# EasyEDA Pro project Schematic.epro

# Schematic Circuit Wenglor
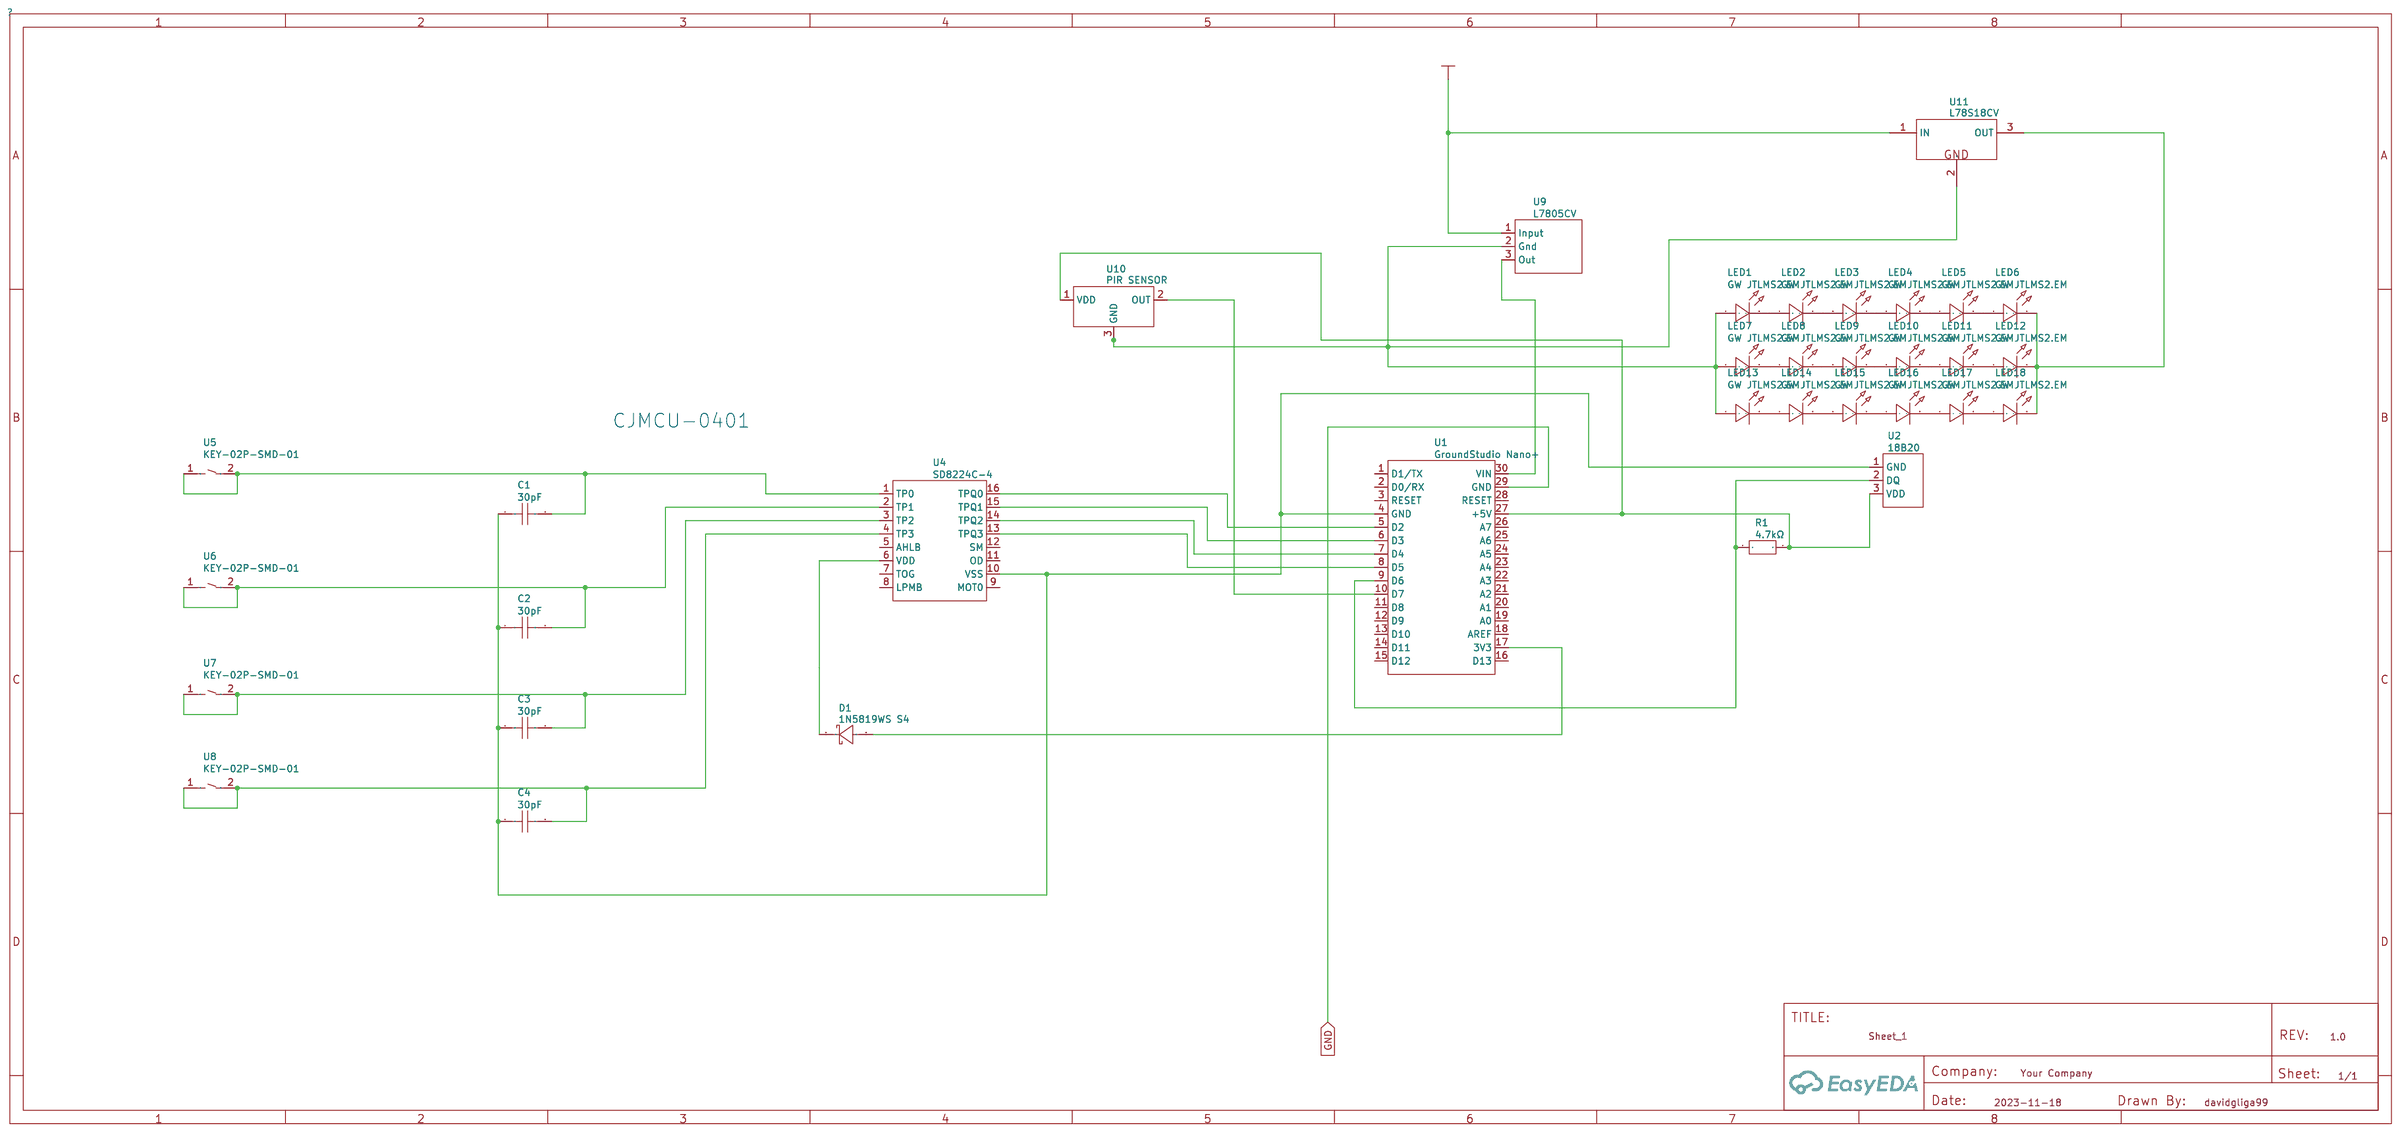
[diagram p0: schematic sheet]

## Parts
C1  30pF  [C0402]
C2  30pF  [C0402]
C3  30pF  [C0402]
C4  30pF  [C0402]
D1  1N5819WS S4  [SOD-323_L1.6-W1.3-LS2.7-RD]
LED1  GW JTLMS2.EM  [LED-SMD_L3.5-W2.8_28353V60MA6500K]
LED2  GW JTLMS2.EM  [LED-SMD_L3.5-W2.8_28353V60MA6500K]
LED3  GW JTLMS2.EM  [LED-SMD_L3.5-W2.8_28353V60MA6500K]
LED4  GW JTLMS2.EM  [LED-SMD_L3.5-W2.8_28353V60MA6500K]
LED5  GW JTLMS2.EM  [LED-SMD_L3.5-W2.8_28353V60MA6500K]
LED6  GW JTLMS2.EM  [LED-SMD_L3.5-W2.8_28353V60MA6500K]
LED7  GW JTLMS2.EM  [LED-SMD_L3.5-W2.8_28353V60MA6500K]
LED8  GW JTLMS2.EM  [LED-SMD_L3.5-W2.8_28353V60MA6500K]
LED9  GW JTLMS2.EM  [LED-SMD_L3.5-W2.8_28353V60MA6500K]
LED10  GW JTLMS2.EM  [LED-SMD_L3.5-W2.8_28353V60MA6500K]
LED11  GW JTLMS2.EM  [LED-SMD_L3.5-W2.8_28353V60MA6500K]
LED12  GW JTLMS2.EM  [LED-SMD_L3.5-W2.8_28353V60MA6500K]
LED13  GW JTLMS2.EM  [LED-SMD_L3.5-W2.8_28353V60MA6500K]
LED14  GW JTLMS2.EM  [LED-SMD_L3.5-W2.8_28353V60MA6500K]
LED15  GW JTLMS2.EM  [LED-SMD_L3.5-W2.8_28353V60MA6500K]
LED16  GW JTLMS2.EM  [LED-SMD_L3.5-W2.8_28353V60MA6500K]
LED17  GW JTLMS2.EM  [LED-SMD_L3.5-W2.8_28353V60MA6500K]
LED18  GW JTLMS2.EM  [LED-SMD_L3.5-W2.8_28353V60MA6500K]
R1  4.7kΩ  [RES-TH_BD2.4-L6.3-P10.30-D0.6]
U1  GroundStudio Nano+  [COMM-TH_ARDUINO_NANO]
U2  18B20  [TO-92-3_L4.9-W3.7-P2.54-L]
U4  SD8224C-4  [SOP-16_L10.0-W3.9-P1.27-LS6.0-BL]
U5  KEY-02P-SMD-01  [KEY-SMD_L4.0-W3.0-LS4.9]
U6  KEY-02P-SMD-01  [KEY-SMD_L4.0-W3.0-LS4.9]
U7  KEY-02P-SMD-01  [KEY-SMD_L4.0-W3.0-LS4.9]
U8  KEY-02P-SMD-01  [KEY-SMD_L4.0-W3.0-LS4.9]
U9  L7805CV  [TO-220-3_L10.0-W4.5-P2.54-L]
U10  PIR SENSOR  [PIR-TH_EKMB4308112K]
U11  L78S18CV

## Library data of the parts
C1-C4 = 30pF: Supplier: LCSC; Supplier Part: C726127; Manufacturer: YAGEO(国巨); Manufacturer Part: AC0402JRNPO9BN300; JLCPCB Part Class: Extended Part; link: https://lcsc.com/eda_search?q=C726127&amp;%26type=1&amp;ref=editor
D1 = 1N5819WS S4: Supplier: LCSC; Supplier Part: C2927280; Manufacturer: JSMSEMI(杰盛微); JLCPCB Part Class: Extended Part; link: https://lcsc.com/eda_search?q=C2927280&amp;%26type=1&amp;ref=editor
LED1-LED18 = GW JTLMS2.EM: Supplier: LCSC; Supplier Part: C9900023603; Manufacturer: null; JLCPCB Part Class: Extended Part; link: https://lcsc.com/eda_search?q=C9900023603&amp;%26type=1&amp;ref=editor
R1 = 4.7kΩ: Supplier: LCSC; Supplier Part: C385509; Manufacturer: Tyohm(幸亚电阻); Manufacturer Part: RN1/2WS4.7KΩFT/BA1; JLCPCB Part Class: Extended Part; link: https://lcsc.com/eda_search?q=C385509&amp;%26type=1&amp;ref=editor
U1 = GroundStudio Nano+: Supplier: LCSC; Supplier Part: C9900017879; Manufacturer: null; Manufacturer Part: ARDUINO_NANO; JLCPCB Part Class: Extended Part; link: https://lcsc.com/eda_search?q=C9900017879&amp;%26type=1&amp;ref=editor
U2 = 18B20: Supplier: LCSC; Supplier Part: C4945083; Manufacturer: I-CORE(中微爱芯); JLCPCB Part Class: Extended Part; link: https://lcsc.com/eda_search?q=C4945083&amp;%26type=1&amp;ref=editor
U4 = SD8224C-4: Supplier: LCSC; Supplier Part: C521406; Manufacturer: SHOUDING(首鼎半导体); JLCPCB Part Class: Extended Part; link: https://lcsc.com/eda_search?q=C521406&amp;%26type=1&amp;ref=editor
U5-U8 = KEY-02P-SMD-01: Supplier: LCSC; Supplier Part: C9900002655; Manufacturer: null; JLCPCB Part Class: Extended Part; link: https://lcsc.com/eda_search?q=C9900002655&amp;%26type=1&amp;ref=editor
U9 = L7805CV: Supplier: LCSC; Supplier Part: C347289; Manufacturer: UMW(广东友台半导体); JLCPCB Part Class: Extended Part
U10 = PIR SENSOR: Supplier: LCSC; Supplier Part: C3678765; Manufacturer: PANASONIC(松下); Manufacturer Part: EKMC1609112
U11 = L78S18CV

## Nets
24V: U9.1(Input) U11.1(IN)
GND: U1.29(GND)
Net-(C1-1): C1.1 C2.1 C3.1 C4.1 U1.4(GND) U2.1(GND) U4.10(VSS)
Net-(C1-2): C1.2 U4.1(TP0) U5.1 U5.2
Net-(C2-2): C2.2 U4.2(TP1) U6.1 U6.2
Net-(C3-2): C3.2 U4.3(TP2) U7.1 U7.2
Net-(C4-2): C4.2 U4.4(TP3) U8.1 U8.2
Net-(D1-1): D1.1(C) U4.6(VDD)
Net-(D1-2): D1.2(A) U1.17(3V3)
Net-(LED1-1): LED1.1(+) LED7.1(+) LED13.1(+) U9.2(Gnd) U10.3(GND) U11.2(GND)
Net-(LED1-2): LED1.2(-) LED2.1(+)
Net-(LED2-2): LED2.2(-) LED3.1(+)
Net-(LED3-2): LED3.2(-) LED4.1(+)
Net-(LED4-2): LED4.2(-) LED5.1(+)
Net-(LED5-2): LED5.2(-) LED6.1(+)
Net-(LED6-2): LED6.2(-) LED12.2(-) LED18.2(-) U11.3(OUT)
Net-(LED7-2): LED7.2(-) LED8.1(+)
Net-(LED8-2): LED8.2(-) LED9.1(+)
Net-(LED9-2): LED9.2(-) LED10.1(+)
Net-(LED10-2): LED10.2(-) LED11.1(+)
Net-(LED11-2): LED11.2(-) LED12.1(+)
Net-(LED13-2): LED13.2(-) LED14.1(+)
Net-(LED14-2): LED14.2(-) LED15.1(+)
Net-(LED15-2): LED15.2(-) LED16.1(+)
Net-(LED16-2): LED16.2(-) LED17.1(+)
Net-(LED17-2): LED17.2(-) LED18.1(+)
Net-(R1-1): R1.1 U1.9(D6) U2.2(DQ)
Net-(R1-2): R1.2 U1.27(+5V) U2.3(VDD) U10.1(VDD)
Net-(U1-5): U1.5(D2) U4.16(TPQ0)
Net-(U1-6): U1.6(D3) U4.15(TPQ1)
Net-(U1-7): U1.7(D4) U4.14(TPQ2)
Net-(U1-8): U1.8(D5) U4.13(TPQ3)
Net-(U1-10): U1.10(D7) U10.2(OUT)
Net-(U1-30): U1.30(VIN) U9.3(Out)

Not connected (* = marked no-connect by the designer): U1 1(D1/TX) 2(D0/RX) 3(RESET) 11(D8) 12(D9) 13(D10) 14(D11) 15(D12) 16(D13) 18(AREF) 19(A0) 20(A1) 21(A2) 22(A3) 23(A4) 24(A5) 25(A6) 26(A7) 28(RESET); U4 5(AHLB) 7(TOG) 8(LPMB) 9(MOT0) 11(OD) 12(SM)

## Notes on the sheet
- CJMCU-0401
